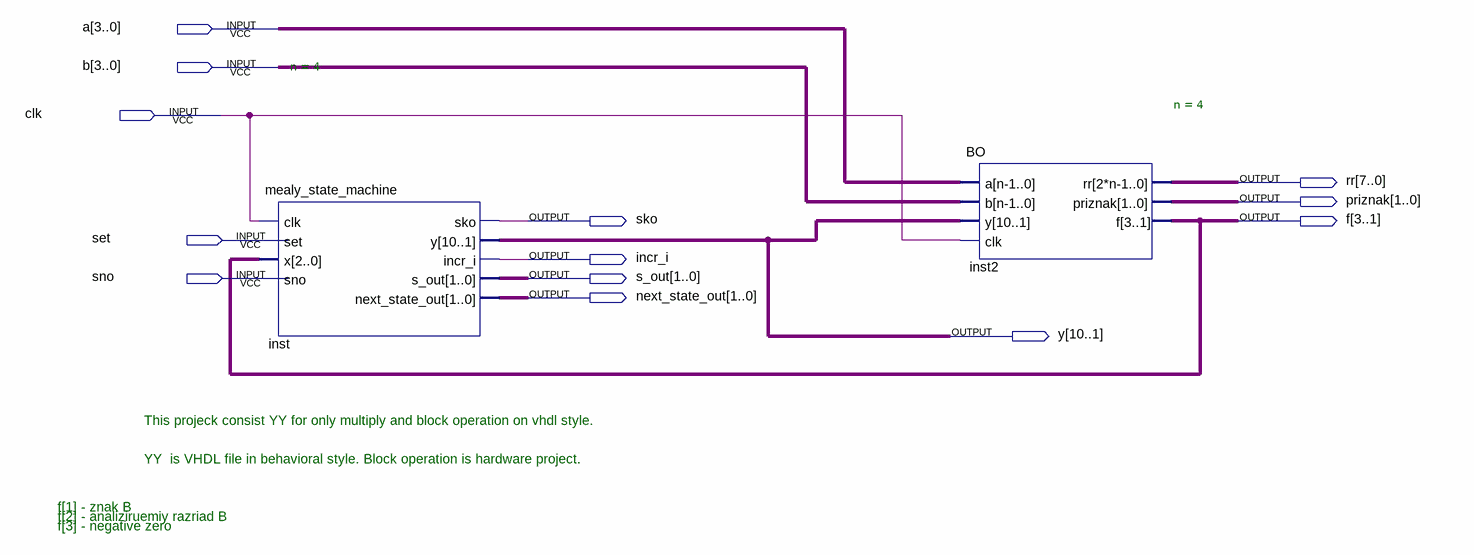
[diagram p0: schematic sheet]
// Quartus schematic alu_vhdl.bdf as structural Verilog: 2 symbols, 13 pins
module alu_vhdl (
  input  [3:0] a,
  input  [3:0] b,
  input  clk,
  input  set,
  input  sno,
  output [7:0] rr,
  output [1:0] priznak,
  output sko,
  output [3:1] f,
  output incr_i,
  output [1:0] s_out,
  output [1:0] next_state_out,
  output [10:1] y
);

  mealy_state_machine #(.n(4)) inst (
    .clk(clk), .set(set), .x(f), .sno(sno), .sko(sko), .y(y), .incr_i(incr_i), .s_out(s_out),
    .next_state_out(next_state_out));
  BO #(.n(4)) inst2 (.a(a), .b(b), .y(y), .clk(clk), .rr(rr), .priznak(priznak), .f(f));

  // Notes on the sheet:
  //   This projeck consist YY for only multiply and block operation on vhdl style.
  //   YY  is VHDL file in behavioral style. Block operation is hardware project.
  //   f[1] - znak B
  //   f[2] - analiziruemiy razriad B
  //   f[3] - negative zero
endmodule
